# EAGLE board Drobit_V2.0 (EAGLE 7.5.0), part 1 of 2
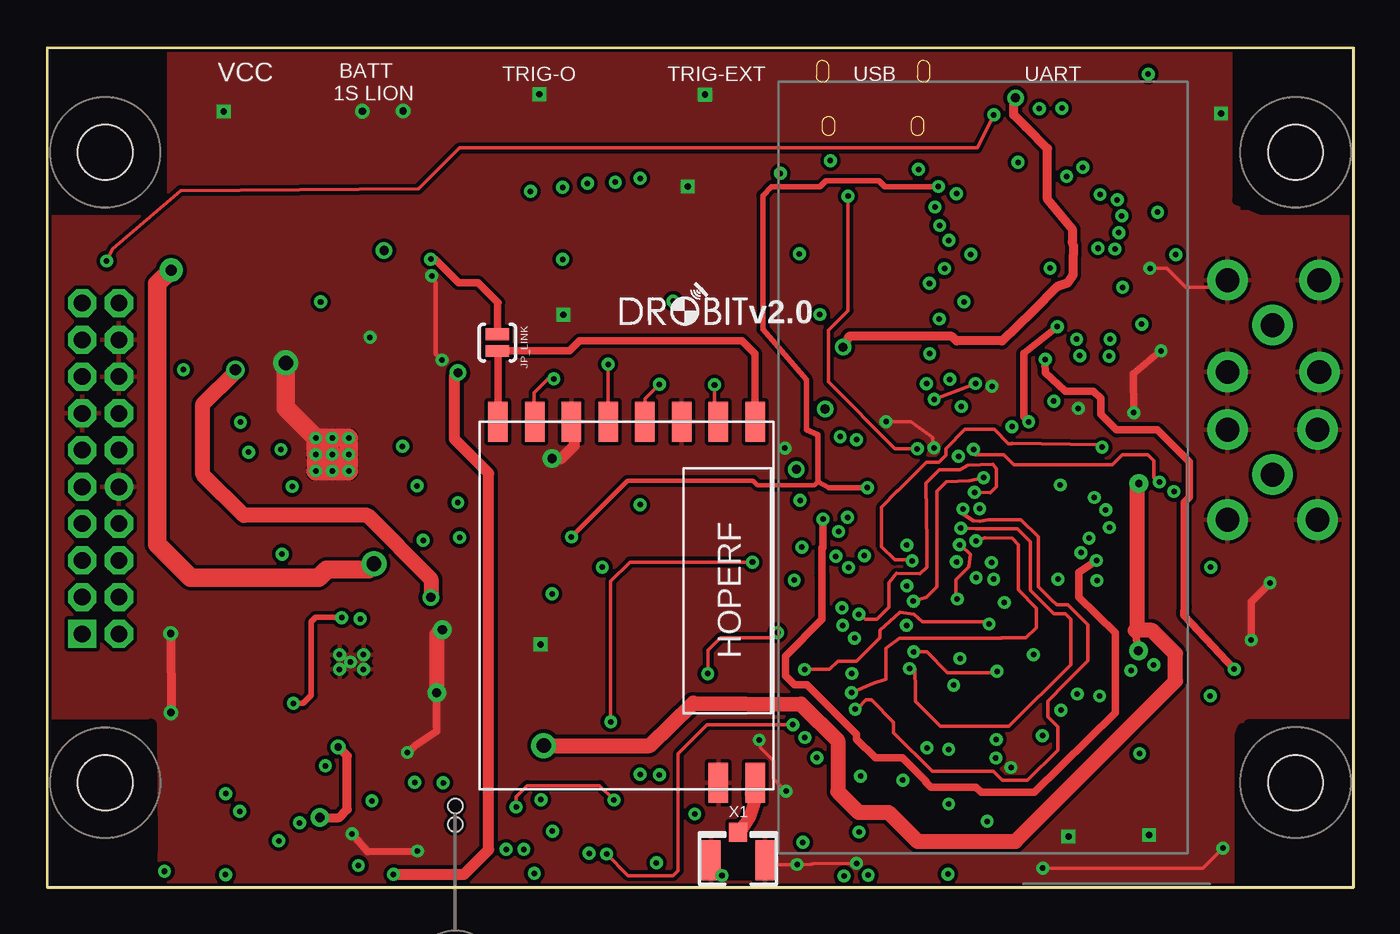
[diagram p14: board, top side]
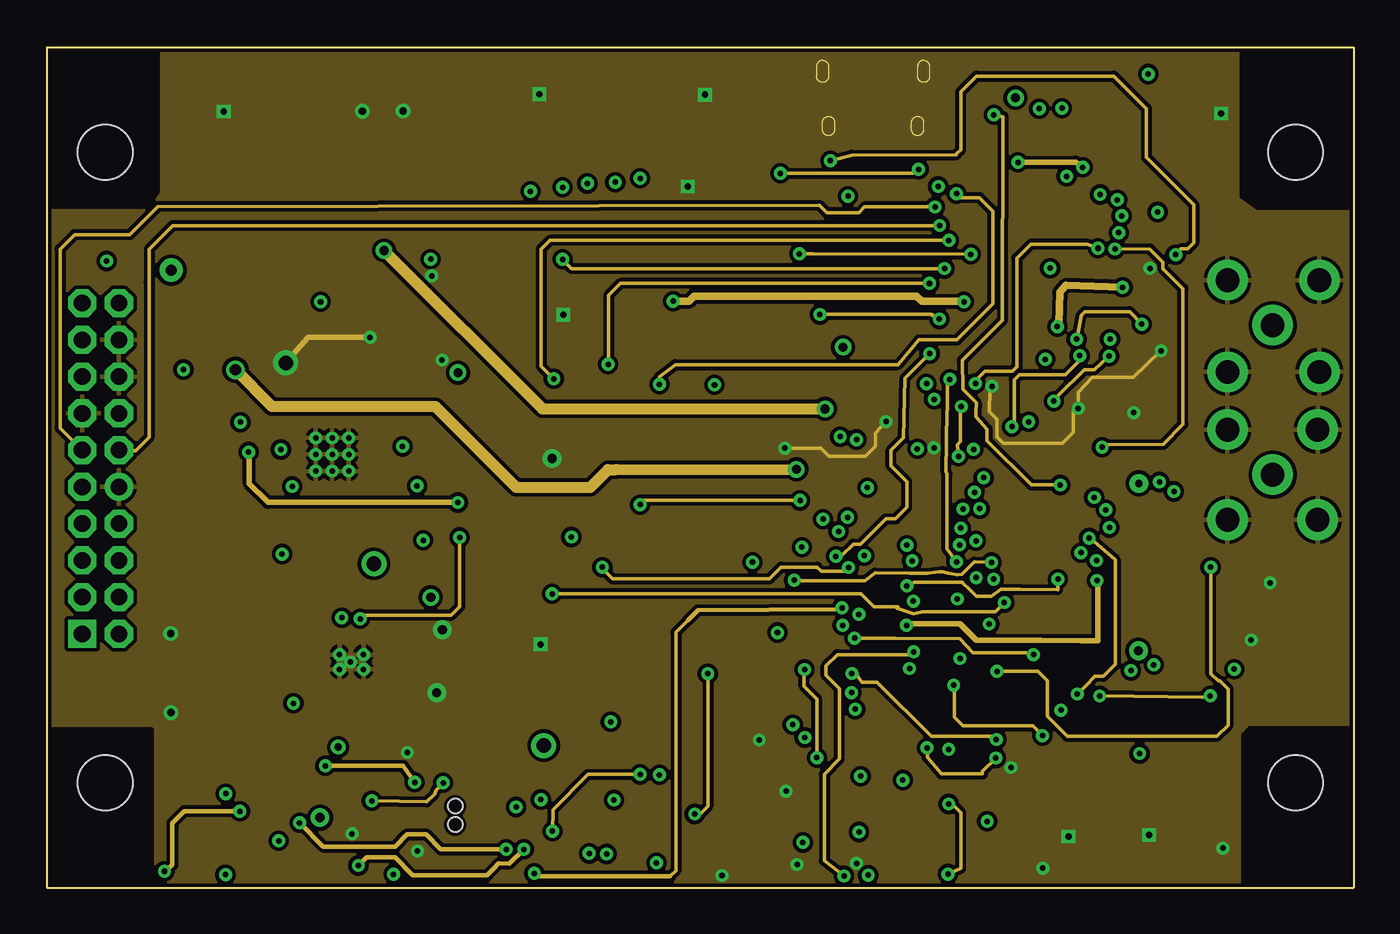
[diagram p15: board, inner layer Route2]
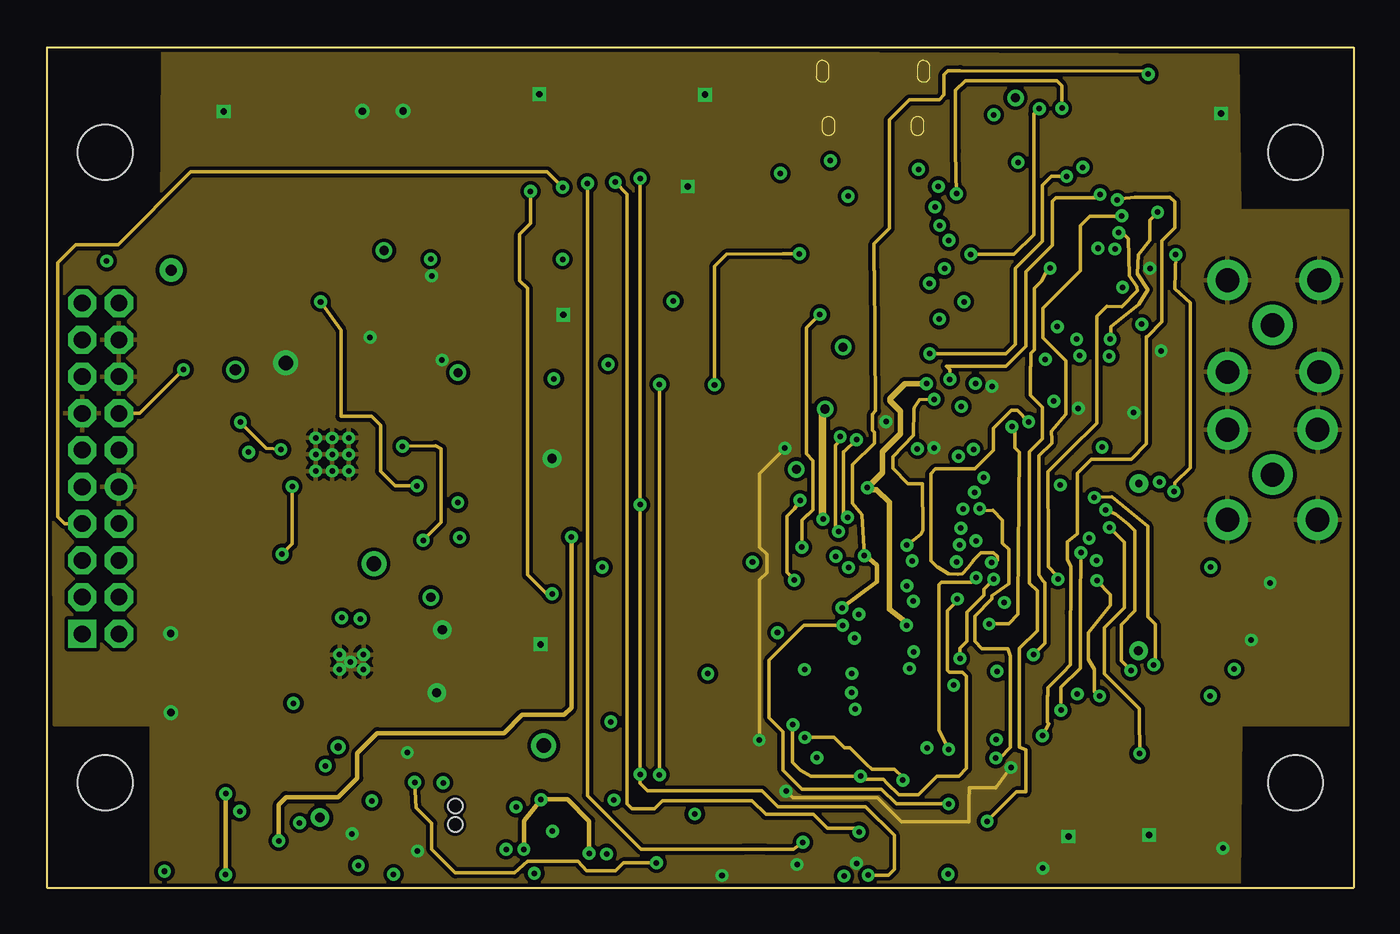
[diagram p16: board, inner layer Route3]
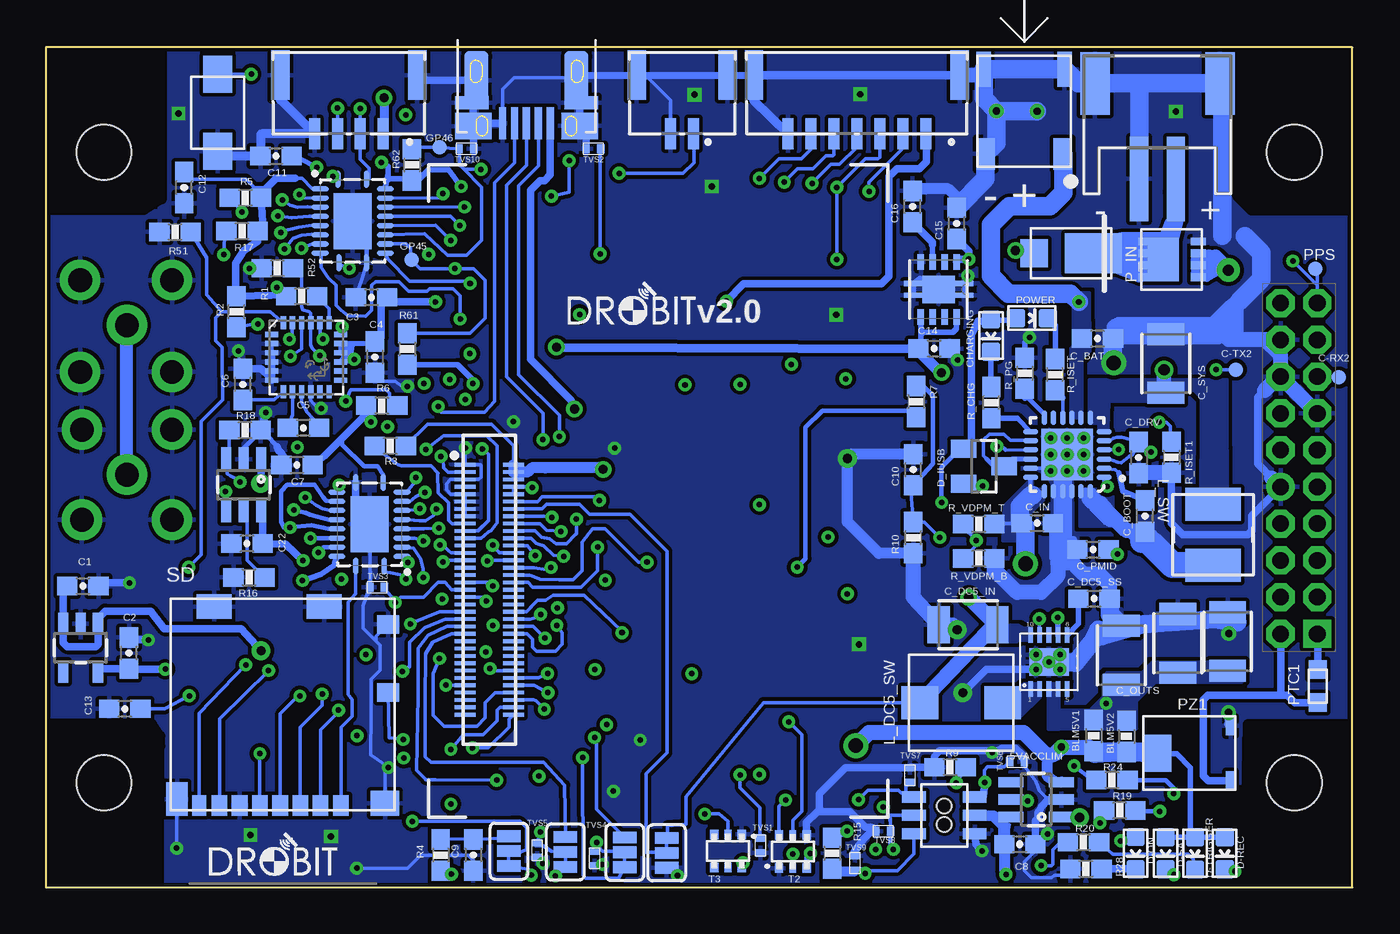
[diagram p17: board, bottom side, seen from below]

Size 71.12 x 45.72 mm. Coordinates in mm from the lower left corner, seen from the top.
Outline: 71.12,45.72 71.12,0 0,0 0,45.72 71.12,45.72
Copper layers (1+2*3+16): Top 0.018mm / dielectric 0.36mm / Route2 0.035mm / dielectric 0.71mm / Route3 0.035mm / dielectric 0.36mm / Bottom 0.018mm
Design rules "eC_4Layer_DRONING *": minimum track width 0.2mm, minimum drill 0.3mm, track to track 0.2mm, track to pad 0.2mm, pad to pad 0.2mm, via to via 0.2mm, smd to smd 0mil, copper to edge 0.2mm, drill to drill 0.35mm, minimum pad ring 0.2mm, minimum via ring 0.2mm, stop-mask expansion 0mil, vias tented up to drill 0.45mm, thermal gap 0.2mm
tRestrict: 31 lines
bRestrict: 31 lines

## Footprints (pad centres in the part's own frame; a part is rotated, then mirrored left to right if it is on the bottom)
SOT23-6 = smd 0.55 x 1.35: 1 -0.95,-1.375; 2 0,-1.375; 3 0.95,-1.375; 4 0.95,1.375; 5 0,1.375; 6 -0.95,1.375
SM02B-SFHRS-TF = smd 1.7 x 1: 1 2.3,2.1; 2 2.3,-2.1 | smd 1.9 x 0.8: GND -2.3,2.2; GND1 -2.3,-2.2
0603 = smd 1.1 x 1: 1 -0.85,0; 2 0.85,0
0603-CAP = smd 1.1 x 1: 1 -0.85,0; 2 0.85,0
TP08R = smd 0.8 x 0.8: TP 0,0
1210 = smd 1.2 x 2: 1 -1.6,0; 2 1.6,0
QFN50P400X400X100-25N = smd 0.8 x 0.3: 1 -2,1.25; 2 -2,0.75; 3 -2,0.25; 4 -2,-0.25; 5 -2,-0.75; 6 -2,-1.25; 13 2,-1.25; 14 2,-0.75; 15 2,-0.25; 16 2,0.25; 17 2,0.75; 18 2,1.25 | smd 0.3 x 0.8: 7 -1.25,-2; 8 -0.75,-2; 9 -0.25,-2; 10 0.25,-2; 11 0.75,-2; 12 1.25,-2; 19 1.25,2; 20 0.75,2; 21 0.25,2; 22 -0.25,2; 23 -0.75,2; 24 -1.25,2 | smd 2.8 x 2.8: 25 0,0 | drill 0.3 pad 0.5: P$2 -0.9,0.9; P$3 0,0.9; P$4 0.9,0.9; P$5 0.9,0; P$6 0,0; P$7 -0.9,0; P$8 -0.9,-0.9; P$9 0,-0.9; P$10 0.9,-0.9
LED-0603 = smd 1 x 1: A 0,-0.877; C 0,0.877
V8PAN50-M3/I = smd 1.5 x 1.52: A 2.01,0 | smd 3.1 x 2.2: C -1.21,0
SOT23 = smd 1 x 1.4: 1 -0.95,-1.1; 2 0.95,-1.1; 3 0,1.1
SON65P300X300X100-9N = smd 0.85 x 0.35: 1 -1.5,0.975; 2 -1.5,0.325; 3 -1.5,-0.325; 4 -1.5,-0.975; 5 1.5,-0.975; 6 1.5,-0.325; 7 1.5,0.325; 8 1.5,0.975 | smd 1.5 x 1.75: GND 0,0 | smd 0.28 x 1.025: GND1 -0.325,1.375; GND2 0.325,1.375; GND3 -0.325,-1.375; GND4 0.325,-1.375
SON-10 = drill 0.3 pad 0.6: G1 -0.7,0.4; G2 -0.7,-0.4; G3 0,0; G4 0.6,0.4; G5 0.6,-0.4 | smd 0.28 x 0.825: P$1 -1,-1.465; P$2 -0.5,-1.465; P$3 0,-1.465; P$4 0.5,-1.465; P$5 1,-1.465; P$6 1,1.465; P$7 0.5,1.465; P$8 0,1.465; P$9 -0.5,1.465; P$10 -1,1.465 | smd 2.15 x 1.5: PAD 0,0
M40-3100345R = smd 0.6 x 1.3: 1 -1,1.65; 2 0,1.65; 3 1,1.65; 4 -1,-1.65; 5 0,-1.65; 6 1,-1.65 | hole 0.8: -0.5,0; 0.5,0
PAD-JUMPER-3-2OF3_NC_BY_TRACE_YES_SILK_FULL_BOX = smd 0.635 x 1.27: 1 -0.813,0; 2 0,0; 3 0.813,0
PAD-JUMPER-2-NO_YES_SILK = smd 0.635 x 1.27: 1 -0.45,0; 2 0.45,0
SRP5030T-1R0 = smd 2 x 1.8: P$1 -2.25,0; P$2 2.25,0
FDSD0420 = smd 1.8 x 3: 1 -1.651,0; 2 1.651,0
HM-TRLR-S = smd 2.184 x 1.067: ANT 19.651,15; CONFIG 0,7; GND 0,11; GND2 19.651,13; RESET 0,1; RXD 0,9; SLEEP 0,5; STATUS 0,3; TXD 0,13; VCC 0,15
FR014H5JZ = smd 0.42 x 0.8: 1 -0.975,-1.45; 2 -0.325,-1.45; 3 0.325,-1.45; 4 0.975,-1.45 | smd 0.42 x 0.55: 5 0.975,1.525; 6 0.325,1.525; 7 -0.325,1.525; 8 -0.975,1.525 | smd 2.37 x 1.7: PAD 0,0.45
0602 = smd 1 x 1: P$1 -0.9,0; P$2 0.9,0
JST-PH-2-SMT-RA = smd 1 x 4.6: 1 1,-3.7; 2 -1,-3.7 | smd 1.6 x 3.4: NC1 -3.4,1.5; NC2 3.4,1.5
ZEN056V230A16YC = smd 0.51 x 1.02: GND 2.245,1.486; OUT 2.245,-1.486 | smd 1.51 x 2.03: IN -1.745,0
0603-RES = smd 1.1 x 1: 1 -0.85,0; 2 0.85,0
1040310811 = smd 1.2 x 1: CD1 5.74,6.7; CD2 5.74,10.4 | smd 0.85 x 1.1: D1 3.155,0.55; D2 2.055,0.55; D3 0.955,0.55; D4 -0.145,0.55; D5 -1.245,0.55; D6 -2.345,0.55; D7 -3.445,0.55 | smd 0.75 x 1.1: D8 -4.545,0.55 | smd 1.17 x 1.8: GND -5.755,0.9 | smd 1.55 x 1.35: GND1 5.565,0.675 | smd 1.9 x 1.35: GND2 -3.73,11.375; GND3 2.24,11.375
SKRKAEE010 = smd 2 x 1.6: I -2.1,0; O 2.1,0
SOT363 = smd 0.5 x 0.5: 1 -0.9,0.75; 3 -0.9,-0.75; 4 0.9,-0.75; 6 0.9,0.75 | smd 0.5 x 0.4: 2 -0.9,0; 5 0.9,0
JST-GH-2 = smd 0.6 x 1.7: 1 0.625,-5.45; 2 -0.625,-5.45 | smd 1 x 2.7: P1 2.475,-2.25; P2 -2.475,-2.25
JST-GH-7 = smd 0.6 x 1.7: 1 3.75,-5.45; 2 2.5,-5.45; 3 1.25,-5.45; 4 0,-5.45; 5 -1.25,-5.45; 6 -2.5,-5.45; 7 -3.75,-5.45 | smd 1 x 2.7: P1 5.6,-2.25; P2 -5.6,-2.25
1005 = smd 0.4 x 0.5: 1 -0.4,0; 2 0.4,0
LGA-24 = smd 0.7 x 0.29: 1 -1.875,1.25; 2 -1.875,0.75; 3 -1.875,0.25; 4 -1.875,-0.25; 5 -1.875,-0.75; 6 -1.875,-1.25; 13 1.875,-1.25; 14 1.875,-0.75; 15 1.875,-0.25; 16 1.875,0.25; 17 1.875,0.75; 18 1.875,1.25 | smd 0.29 x 0.7: 7 -1.25,-1.875; 8 -0.75,-1.875; 9 -0.25,-1.875; 10 0.25,-1.875; 11 0.75,-1.875; 12 1.25,-1.875; 19 1.25,1.875; 20 0.75,1.875; 21 0.25,1.875; 22 -0.25,1.875; 23 -0.75,1.875; 24 -1.25,1.875
EDISON_DAUGHTER = smd 1.14 x 0.2: 1 1.98,19.17; 2 4.62,19.17; 3 1.98,18.77; 4 4.62,18.77; 5 1.98,18.37; 6 4.62,18.37; 7 1.98,17.97; 8 4.62,17.97; 9 1.98,17.57; 10 4.62,17.57; 11 1.98,17.17; 12 4.62,17.17; 13 1.98,16.77; 14 4.62,16.77; 15 1.98,16.37; 16 4.62,16.37; 17 1.98,15.97; 18 4.62,15.97; 19 1.98,15.57; 20 4.62,15.57; 21 1.98,15.17; 22 4.62,15.17; 23 1.98,14.77; 24 4.62,14.77; 25 1.98,14.37; 26 4.62,14.37; 27 1.98,13.97; 28 4.62,13.97; 29 1.98,13.57; 30 4.62,13.57; 31 1.98,13.17; 32 4.62,13.17; 33 1.98,12.77; 34 4.62,12.77; 35 1.98,12.37; 36 4.62,12.37; 37 1.98,11.97; 38 4.62,11.97; 39 1.98,11.57; 40 4.62,11.57; 41 1.98,11.17; 42 4.62,11.17; 43 1.98,10.77; 44 4.62,10.77; 45 1.98,10.37; 46 4.62,10.37; 47 1.98,9.97; 48 4.62,9.97; 49 1.98,9.57; 50 4.62,9.57; 51 1.98,9.17; 52 4.62,9.17; 53 1.98,8.77; 54 4.62,8.77; 55 1.98,8.37; 56 4.62,8.37; 57 1.98,7.97; 58 4.62,7.97; 59 1.98,7.57; 60 4.62,7.57; 61 1.98,7.17; 62 4.62,7.17; 63 1.98,6.77; 64 4.62,6.77; 65 1.98,6.37; 66 4.62,6.37; 67 1.98,5.97; 68 4.62,5.97; 69 1.98,5.57; 70 4.62,5.57
SOT23-5 = smd 0.55 x 1.2: 1 -0.95,-1.3; 2 0,-1.3; 3 0.95,-1.3; 4 0.95,1.3; 5 -0.95,1.3
R-PVQFN-N20 = smd 0.95 x 0.28: 1 -2.275,-0.8; 10 2.275,-0.75; 11 2.275,0.75; 20 -2.275,0.75 | smd 0.28 x 0.95: 2 -1.75,-1.775; 3 -1.25,-1.775; 4 -0.75,-1.775; 5 -0.25,-1.775; 6 0.25,-1.775; 7 0.75,-1.775; 8 1.25,-1.775; 9 1.75,-1.775; 12 1.75,1.775; 13 1.25,1.775; 14 0.75,1.775; 15 0.25,1.775; 16 -0.25,1.775; 17 -0.75,1.775; 18 -1.25,1.775; 19 -1.75,1.775 | smd 3.05 x 2.05: EPAD 0,0
COMNAV_501G = drill 1.3: ANT -7.75,31.15; GNDA -10.2,33.7; GNDA1 -5.2,33.7; GNDA2 -10.2,28.7; GNDA3 -5.2,28.7 | drill 0.9 octagon: COM1_RX -0.95,-31.65; COM1_TX -0.95,-33.65; COM2_RX -4.95,-33.65; COM2_TX -2.95,-31.65; COM3_RX 7.05,-31.65; COM3_TX 1.05,-33.65; EVENT 3.05,-33.65; GND_2 -2.95,-33.65; GND_3 -4.95,-31.65; GND_4 -6.95,-31.65; NC_1 7.05,-33.65; NC_2 5.05,-31.65; PPS -8.95,-33.65; RESETIN 5.05,-33.65; RFU -6.95,-33.65; RTK_LED 3.05,-31.65; SAT_LED -8.95,-31.65; VIN 9.05,-31.65 | drill 0.9: GND_1 1.05,-31.65 | drill 0.9 square: LNA_PWR 9.05,-33.65 | hole 3: -17.15,32.4; 17.15,32.4; -17.15,-32.4; 17.15,-32.4
1-1337586-0 = drill 1.3 pad 2.2: ANT 0,0; GND1 -2.45,2.45; GND2 -2.45,-2.45; GND3 2.45,2.45; GND4 2.45,-2.45
JST-GH-4 = smd 0.6 x 1.7: 1 1.875,-5.45; 2 0.625,-5.45; 3 -0.625,-5.45; 4 -1.875,-5.45 | smd 1 x 2.7: P1 3.725,-2.25; P2 -3.725,-2.25
POS-5 = smd 0.4 x 1.75: 1 -1.3,1.35; 2 -0.65,1.35; 3 0,1.35; 4 0.65,1.35; 5 1.3,1.35 | smd 2 x 1.46: PAD1 -2.901,1.494; PAD2 2.897,1.496 | smd 1.825 x 0.7: PAD3 -2.985,0.23; PAD5 2.985,0.23 | smd 1.3 x 3.15: PAD4 -2.723,-1.001; PAD6 2.723,-1.001
U.FL-A-1JB = smd 2.2 x 1.05: 1 0,1.475; 2 0,-1.475 | smd 1.05 x 1: 3 1.525,0

## Placement (x,y rotation side)
5VACCLIM  MIC2039  [SOT23-6]  17.22,4.79 90 bottom
BATT  [SM02B-SFHRS-TF]  17.87,42.23 270 bottom
BLM5V1  BLM18SG221TZ1-2.5A  [0603]  14.09,8.27 270 bottom
BLM5V2  BLM18SG221TZ1-2.5A  [0603]  12.3,8.23 270 bottom
C1  1.0uF  [0603-CAP]  69.1,16.41 0 bottom
C2  22UF  [0603-CAP]  66.59,12.77 90 bottom
C3  1.0uF  [0603-CAP]  53.4,32.12 180 bottom
C4  0.1uF  [0603-CAP]  53.21,28.87 270 bottom
C5  0.22uF  [0603-CAP]  57.1,25.02 180 bottom
C6  4.7uF  [0603-CAP]  60.4,27.39 90 bottom
C7  0.1uF  [0603-CAP]  57.45,22.99 180 bottom
C8  22UF  [0603-CAP]  18.1,2.36 0 bottom
C9  1.0uF  [0603-CAP]  47.86,1.77 270 bottom
C10  1.0uF  [0603-CAP]  23.9,22.74 90 bottom
C11  0.1uF  [0603-CAP]  58.59,39.81 0 bottom
C12  0.1uF  [0603-CAP]  63.59,38.09 90 bottom
C13  0.1uF  [0603-CAP]  66.82,9.73 180 bottom
C14  1.0uF  [0603-CAP]  22.77,29.33 0 bottom
C15  2.2uF  [0603-CAP]  21.54,36.15 90 bottom
C16  10nF  [0603-CAP]  23.94,37.06 90 bottom
C22  22UF  [0603-CAP]  60.17,18.72 180 bottom
C-RX2  TPTP08R  [TP08R]  0.73,27.77 0 bottom
C-TX2  TPTP08R  [TP08R]  6.34,28.19 0 bottom
C_BAT  1.0uF  [0603-CAP]  13.88,29.88 180 bottom
C_BOOT  0.033uF  [0603-CAP]  11.29,20.22 90 bottom
C_DC5_IN  22uF  [1210]  20.92,14.3 180 bottom
C_DC5_OUT1  10uF  [1210]  12.58,12.64 90 bottom
C_DC5_OUT2  10uF  [1210]  9.49,13.29 90 bottom
C_DC5_SS  270nF  [0603-CAP]  14.06,15.72 0 bottom
C_DRV  2.2uF  [0603-CAP]  11.63,23.4 270 bottom
C_IN  4.7uF  [0603-CAP]  17.15,19.83 0 bottom
C_OUTS  10uF  [1210]  6.79,13.39 90 bottom
C_PMID  1uF  [0603-CAP]  14.12,18.39 0 bottom
C_SYS  10uF  [1210]  10.16,28.52 90 bottom
CHARGER  BQ24266  [QFN50P400X400X100-25N]  15.52,23.57 180 bottom
CHARGING  ORANGE - APT1608SECK/J4-PRV  [LED-0603]  19.67,30.04 180 bottom
D-ON  ROJO - APT1608SECK/J3-PRV  [LED-0603]  11.8,1.87 180 bottom
D-REC  ORANGE - APT1608SECK/J4-PRV  [LED-0603]  6.95,1.87 180 bottom
D-SAT  VERDE - APT1608ZGCK  [LED-0603]  10.17,1.87 180 bottom
D-TRIGGER  BLUE - APT1608VBC/D  [LED-0603]  8.56,1.86 180 bottom
D_IN  V8PAN50-M3/I  [V8PAN50-M3/I]  15.31,34.52 180 bottom
D_IUSB  BAT54C  [SOT23]  20.06,22.93 270 bottom
DC3VLINK  TPS73501DRBT  [SON65P300X300X100-9N]  22.52,32.55 270 bottom
DC5V  TPS61232  [SON-10]  16.52,12.28 0 bottom
EXT-INTERFACE  M40-3100345R  [M40-3100345R]  22.21,3.93 90 bottom
GP45  TPTP08R  [TP08R]  51.22,34.16 0 bottom
GP46  TPTP08R  [TP08R]  49.7,40.3 180 bottom
JP-DCIN  [PAD-JUMPER-3-2OF3_NC_BY_TRACE_YES_SILK_FULL_BOX]  37.33,1.89 90 bottom
JP-ENABLE-UART2  [PAD-JUMPER-3-2OF3_NC_BY_TRACE_YES_SILK_FULL_BOX]  45.92,1.98 270 bottom
JP-SCL  [PAD-JUMPER-3-2OF3_NC_BY_TRACE_YES_SILK_FULL_BOX]  39.61,1.92 270 bottom
JP-SDA  [PAD-JUMPER-3-2OF3_NC_BY_TRACE_YES_SILK_FULL_BOX]  42.84,1.94 270 bottom
JP_LINK  JUMPER-PAD-2-NOYES_SILK  [PAD-JUMPER-2-NO_YES_SILK]  24.51,29.66 270 top
L_DC5_SW  SPR5030T-1R0  [SRP5030T-1R0]  21.29,10.06 0 bottom
L_SW  1.5uH  [FDSD0420]  7.58,19.2 90 bottom
LINK  HM-TRLR-S  [HM-TRLR-S]  23.54,25.35 270 top
P_IN  FR014H5JZ  [FR014H5JZ]  9.84,34.19 90 bottom
POWER  ROJO - APT1608SECK/J3-PRV  [LED-0603]  17.45,30.99 270 bottom
PPS  TPTP08R  [TP08R]  2.02,33.67 0 bottom
PTC1  0603L010YR  [0602]  1.88,10.96 90 bottom
PWR  JST_PH_G  [JST-PH-2-SMT-RA]  10.61,42.26 0 bottom
PZ1  ZEN056V230A16YC  [ZEN056V230A16YC]  8.87,7.31 0 bottom
R1  10K  [0603-RES]  57.2,32.18 180 bottom
R2  10K  [0603-RES]  60.75,31.34 90 bottom
R3  10K  [0603-RES]  52.38,24.04 180 bottom
R4  100k  [0603-RES]  49.63,1.77 270 bottom
R5  10K  [0603-RES]  60.26,37.54 0 bottom
R6  10K  [0603-RES]  52.84,26.23 180 bottom
R7  100k  [0603-RES]  23.75,26.45 270 bottom
R9  147  [0603-RES]  21.9,6.55 0 bottom
R10  47K  [0603-RES]  23.9,19.04 90 bottom
R15  10K  [0603-RES]  28.32,1.87 270 bottom
R16  287  [0603-RES]  60.06,16.88 0 bottom
R17  10K  [0603-RES]  60.44,35.72 180 bottom
R18  100k  [0603-RES]  60.28,24.89 180 bottom
R19  180  [0603-RES]  12.67,4.2 180 bottom
R20  105  [0603-RES]  14.63,2.47 180 bottom
R24  105  [0603-RES]  13.08,5.85 180 bottom
R28  82  [0603-RES]  14.51,1.02 0 bottom
R51  4.7K  [0603-RES]  64.09,35.68 0 bottom
R52  4.7K  [0603-RES]  58.53,33.71 0 bottom
R61  10K  [0603-RES]  51.45,29.31 270 bottom
R62  10K  [0603-RES]  51.19,39.33 270 bottom
R_CHG  1.8k  [0603-RES]  19.65,26.39 90 bottom
R_ISET  590  [0603-RES]  17.84,27.99 270 bottom
R_ISET1  10K  [0603-RES]  9.85,23.42 270 bottom
R_PG  1.8k  [0603-RES]  16.18,27.92 90 bottom
R_VDPM_B  10K  [0603-RES]  20.34,17.91 180 bottom
R_VDPM_T  71.5k  [0603-RES]  20.34,19.79 0 bottom
SD  SDCARD  [1040310811]  58.23,3.92 0 bottom
SREC  SKRKAEE010  [SKRKAEE010]  61.77,42.17 270 bottom
T2  BSS138PS  [SOT363]  30.46,1.96 90 bottom
T3  BSS138PS  [SOT363]  33.99,1.99 270 bottom
TRIG-IN  [JST-GH-2]  36.48,46.47 0 bottom
TRIG-OUT  [JST-GH-7]  26.98,46.47 0 bottom
TVS1  LXES15AAA1-133  [1005]  32.23,2.29 90 bottom
TVS2  LXES15AAA1-133  [1005]  41.32,40.2 180 bottom
TVS3  LXES15AAA1-133  [1005]  53.09,16.35 180 bottom
TVS4  LXES15AAA1-133  [1005]  41.24,1.59 90 bottom
TVS5  LXES15AAA1-133  [1005]  44.37,2.04 90 bottom
TVS6  LXES15AAA1-133  [1005]  18.26,6.84 180 bottom
TVS7  LXES15AAA1-133  [1005]  24.08,6.12 270 bottom
TVS8  LXES15AAA1-133  [1005]  25.54,3.07 0 bottom
TVS9  LXES15AAA1-133  [1005]  27.08,1.34 270 bottom
TVS10  LXES15AAA1-133  [1005]  48.23,40.2 0 bottom
U1  LSM9DS0  [LGA-24]  56.95,28.86 0 bottom
U2  EDISON_CONNECTOR_FULLMOUNTING_HOLES  [EDISON_DAUGHTER]  50.28,3.84 0 bottom
U4  MIC52053.3V  [SOT23-5]  69.23,13.05 180 bottom
U7  TXS0108  [R-PVQFN-N20]  54.42,36.27 270 bottom
U9  TXS0108  [R-PVQFN-N20]  53.5,19.77 90 bottom
U$1  COMNAV_501G  [COMNAV_501G]  35.56,22.86 270 top
U$2  MCX-TECON-1-1337586-0  [1-1337586-0]  66.71,22.47 0 top
UART-EXT  [JST-GH-4]  54.63,46.47 0 bottom
USB  10103594-0001LF  [POS-5]  44.96,42.94 180 bottom
USBREG  MIC2039  [SOT23-6]  60.35,21.92 180 bottom
X1  [U.FL-A-1JB]  37.61,1.49 90 top